# EAGLE design rx (EAGLE 7.2.0)
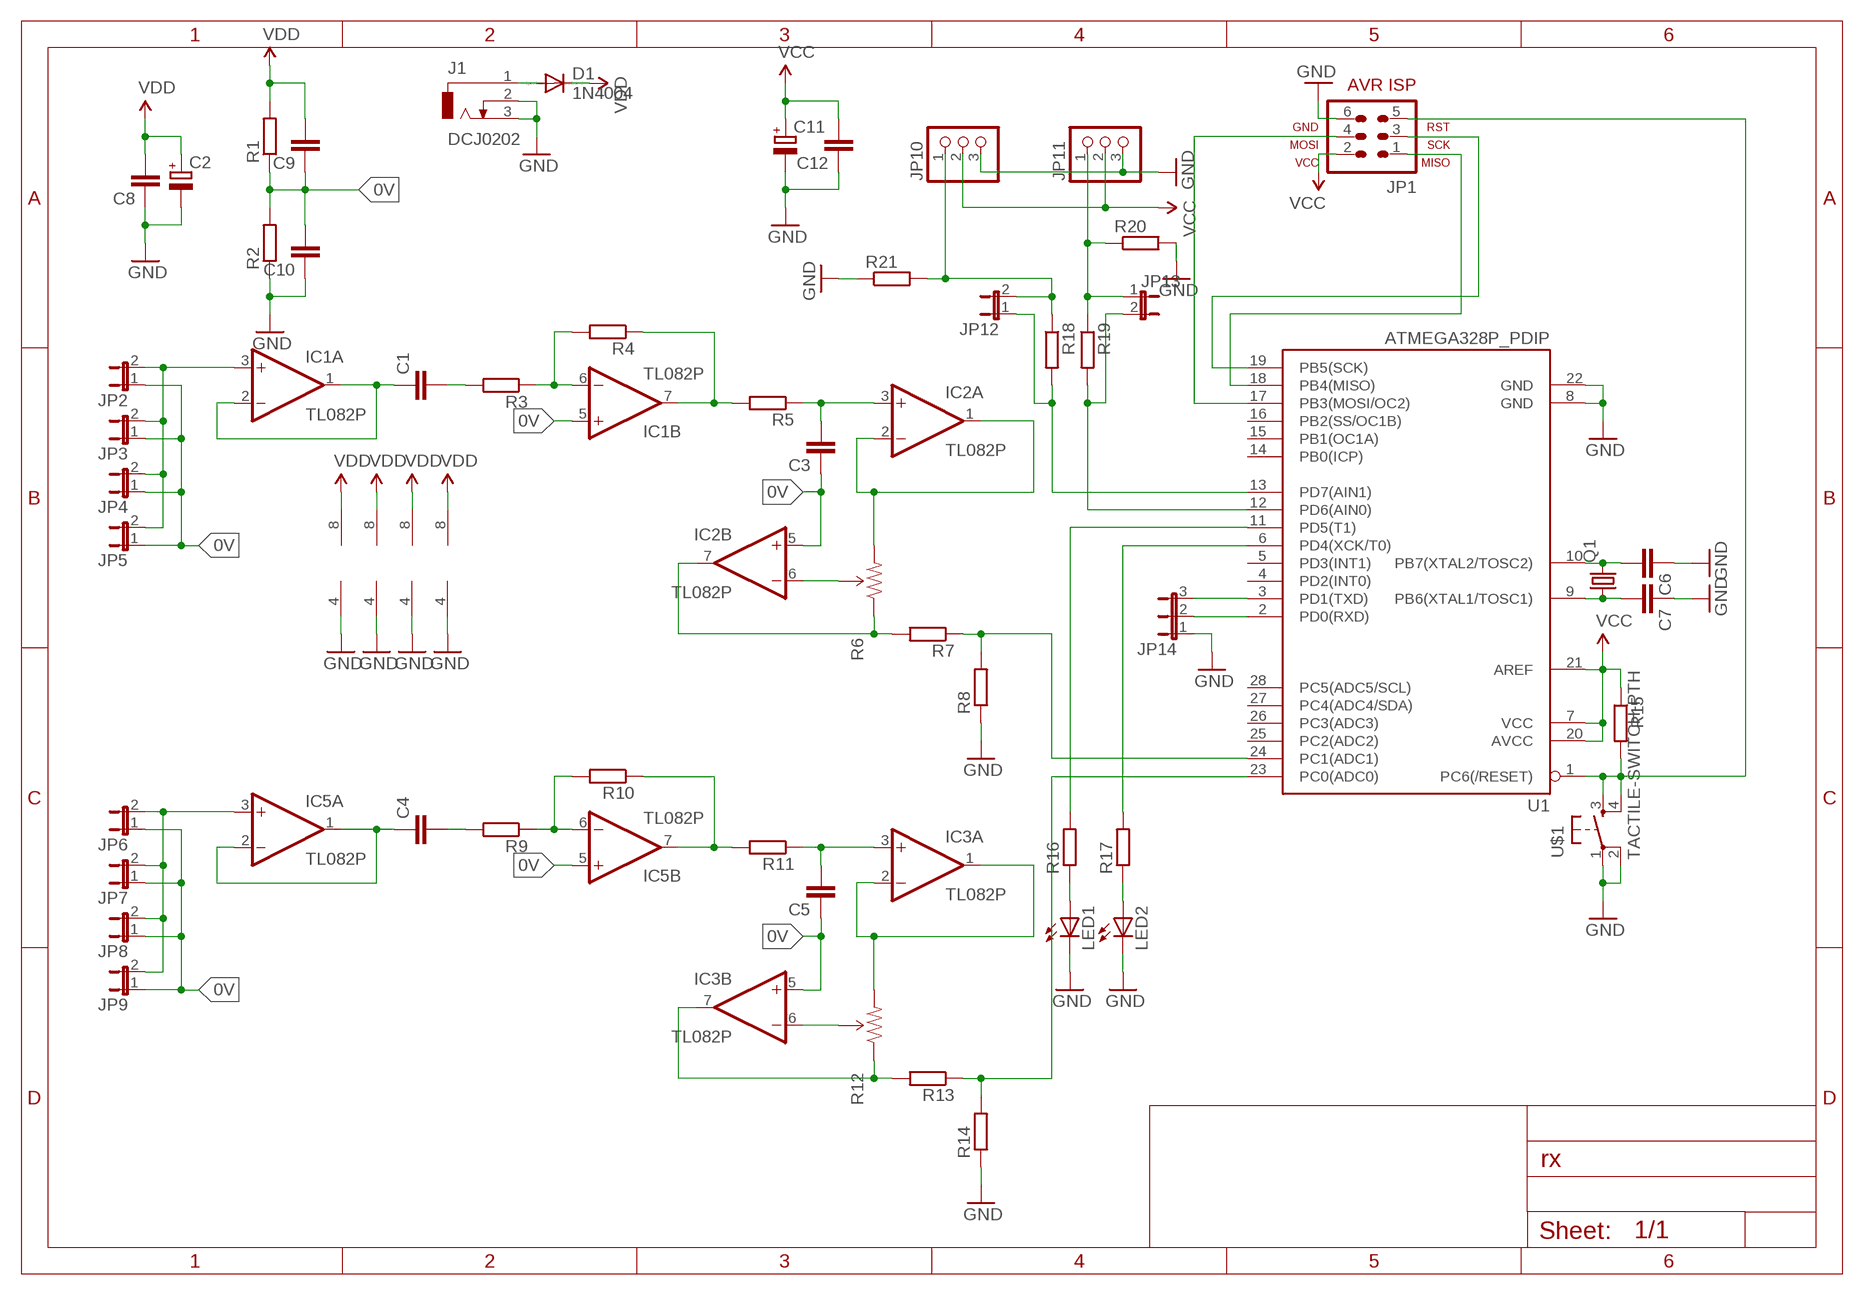
[diagram p0: schematic, sheet 1]

## Parts
C1  C-EU050-030X075  [C050-030X075]
C2  CPOL-EUE5-8.5  [E5-8,5]
C3  C-EU050-030X075  [C050-030X075]
C4  C-EU050-030X075  [C050-030X075]
C5  C-EU050-030X075  [C050-030X075]
C6  C-EU050-030X075  [C050-030X075]
C7  C-EU050-030X075  [C050-030X075]
C8  C-EU050-030X075  [C050-030X075]
C9  C-EU050-030X075  [C050-030X075]
C10  C-EU050-030X075  [C050-030X075]
C11  CPOL-EUE5-8.5  [E5-8,5]
C12  C-EU050-030X075  [C050-030X075]
D1  1N4004  [DO41-10]
IC1  TL082P  [DIL08]
IC2  TL082P  [DIL08]
IC3  TL082P  [DIL08]
IC5  TL082P  [DIL08]
J1  DCJ0202  [DCJ0202]
JP1  AVR-ISP-6VERT  [AVR-ISP-6]
JP2  JP1E  [JP1]
JP3  JP1E  [JP1]
JP4  JP1E  [JP1]
JP5  JP1E  [JP1]
JP6  JP1E  [JP1]
JP7  JP1E  [JP1]
JP8  JP1E  [JP1]
JP9  JP1E  [JP1]
JP10  PINHD-1X3/90  [1X03/90]
JP11  PINHD-1X3/90  [1X03/90]
JP12  JP1E  [JP1]
JP13  JP1E  [JP1]
JP14  JP2E  [JP2]
LED1  LED5MM  [LED5MM]
LED2  LED5MM  [LED5MM]
Q1  CRYSTALHC49U70  [HC49U70]
R1  R-EU_0207/10  [0207/10]
R2  R-EU_0207/10  [0207/10]
R3  R-EU_0207/10  [0207/10]
R4  R-EU_0207/2V  [0207/2V]
R5  R-EU_0207/2V  [0207/2V]
R6  TRIMPOTPTH  [TRIM_POT_PTH]
R7  R-EU_0207/10  [0207/10]
R8  R-EU_0207/10  [0207/10]
R9  R-EU_0207/10  [0207/10]
R10  R-EU_0207/2V  [0207/2V]
R11  R-EU_0207/2V  [0207/2V]
R12  TRIMPOTPTH  [TRIM_POT_PTH]
R13  R-EU_0207/10  [0207/10]
R14  R-EU_0207/10  [0207/10]
R15  R-EU_0207/10  [0207/10]
R16  R-EU_0207/10  [0207/10]
R17  R-EU_0207/10  [0207/10]
R18  R-EU_0207/10  [0207/10]
R19  R-EU_0207/10  [0207/10]
R20  R-EU_0207/10  [0207/10]
R21  R-EU_0207/10  [0207/10]
U1  ATMEGA328P_PDIP  [DIL28-3]
U$1  TACTILE-SWITCH-PTH  [TAC-SWITCH-PTH]

## Nets
0V: C3.1 C5.1 C9.1 C10.2 IC1.5(B:+IN) IC2.5(B:+IN) IC3.5(B:+IN) IC5.5(B:+IN) JP2.1 JP3.1 JP4.1 JP5.1 JP6.1 JP7.1 JP8.1 JP9.1 R1.1 R2.2
GND: C2.- C6.1 C7.1 C8.1 C10.1 C11.- C12.1 IC1.4(P:V-) IC2.4(P:V-) IC3.4(P:V-) IC5.4(P:V-) J1.2 J1.3 JP1.6 JP10.3 JP11.3 JP14.1 LED1.K(C) LED2.K(C) R2.1 R8.1 R14.1 R20.2 R21.1 U1.8(GND) U1.22(GND) U$1.1 U$1.2
N$1: C1.1 IC1.1(A:OUT) IC1.2(A:-IN)
N$2: IC1.3(A:+IN) JP2.2 JP3.2 JP4.2 JP5.2
N$3: C1.2 R3.2
N$4: IC1.6(B:-IN) R3.1 R4.2
N$5: IC1.7(B:OUT) R4.1 R5.2
N$6: IC2.1(A:OUT) IC2.2(A:-IN) R6.3(CW)
N$7: C3.2 IC2.3(A:+IN) R5.1
N$8: D1.A J1.1
N$9: IC2.6(B:-IN) R6.2(WIPER)
N$10: IC2.7(B:OUT) R6.1(CCW) R7.2
N$11: R7.1 R8.2 U1.24(PC1(ADC1))
N$12: IC5.3(A:+IN) JP6.2 JP7.2 JP8.2 JP9.2
N$13: C4.1 IC5.1(A:OUT) IC5.2(A:-IN)
N$14: C4.2 R9.2
N$15: IC5.6(B:-IN) R9.1 R10.2
N$16: IC5.7(B:OUT) R10.1 R11.2
N$17: IC3.1(A:OUT) IC3.2(A:-IN) R12.3(CW)
N$18: C5.2 IC3.3(A:+IN) R11.1
N$19: IC3.6(B:-IN) R12.2(WIPER)
N$20: IC3.7(B:OUT) R12.1(CCW) R13.2
N$21: R13.1 R14.2 U1.23(PC0(ADC0))
N$22: JP11.1 JP13.1 R19.1 R20.1
N$23: C7.2 Q1.1 U1.9(PB6(XTAL1/TOSC1))
N$24: C6.2 Q1.2 U1.10(PB7(XTAL2/TOSC2))
N$25: JP10.1 JP12.2 R18.1 R21.2
N$28: JP14.3 U1.3(PD1(TXD))
N$29: JP14.2 U1.2(PD0(RXD))
N$32: JP1.5 R15.2 U1.1(PC6(/RESET)) U$1.3 U$1.4
N$34: JP1.1 U1.18(PB4(MISO))
N$35: JP1.3 U1.19(PB5(SCK))
N$36: JP1.4 U1.17(PB3(MOSI/OC2))
N$37: LED1.A R16.1
N$38: LED2.A R17.1
N$39: R17.2 U1.6(PD4(XCK/T0))
N$40: R16.2 U1.11(PD5(T1))
N$43: JP13.2 R19.2 U1.12(PD6(AIN0))
N$44: JP12.1 R18.2 U1.13(PD7(AIN1))
VCC: C11.+ C12.2 JP1.2 JP10.2 JP11.2 R15.1 U1.7(VCC) U1.20(AVCC) U1.21(AREF)
VDD: C2.+ C8.2 C9.2 D1.C IC1.8(P:V+) IC2.8(P:V+) IC3.8(P:V+) IC5.8(P:V+) R1.2
Unconnected: U1.4(PD2(INT0)) U1.5(PD3(INT1)) U1.14(PB0(ICP)) U1.15(PB1(OC1A)) U1.16(PB2(SS/OC1B)) U1.25(PC2(ADC2)) U1.26(PC3(ADC3)) U1.27(PC4(ADC4/SDA)) U1.28(PC5(ADC5/SCL))

## Library data of the parts
C1 C3-C10 C12 = resistor:C-EU: CAPACITOR, European symbol
C2 C11 = resistor:CPOL-EU: POLARIZED CAPACITOR, European symbol
D1 = diode:1N4004: DIODE general purpose rectifier, 1 A
IC1-IC3 IC5 = linear:TL082: OP AMP Data sheet <http://www.ti.com/lit/ds/symlink/tl084a . pdf>; DATA_SHEET: <a href="http://www.ti.com/lit/ds/symlink/tl084a.pdf"> Data sheet </a>
J1 = con-jack:DCJ0202: DC POWER JACK Source: DCJ0202.pdf; OC_FARNELL: unknown; OC_NEWARK: unknown
JP1 = avr-7:AVR-ISP-6: AVR ISP-6 Serial Programming Header
JP2-JP9 JP12 JP13 = jumper:JP1E: JUMPER
JP10 JP11 = pinhead:PINHD-1X3: PIN HEADER
JP14 = jumper:JP2E: JUMPER
LED1 LED2 = led:LED: LED OSRAM: - CHIPLED LG R971, LG N971, LY N971, LG Q971, LY Q971, LO R971, LY R971 LH N974, LH R974 LS Q976, LO Q976, LY Q976 LO Q996 - Hyper CHIPLED LW Q18S LB Q993, LB Q99A, LB R99A - SideLED LS A670, LO A670, LY A670, LG A670, LP A670 LB A673, LV A673, LT A673, LW A673 LH A674 LY A675 LS A676, LA A676, LO A676, LY A676, LW A676 LS A679, LY A679, LG A679 - Hyper Micro SIDELED® LS Y876, LA Y876, LO Y876, LY Y876 LT Y87S - SmartLED LW L88C, LW L88S LB L89C, LB L89S, LG L890 LS L89K, LO L89K, LY L89K LS L896, LA L896, LO L896, LY L896 - TOPLED LS T670, LO T670, LY T670, LG T670, LP T670 LSG T670, LSP T670, LSY T670, LOP T670, LYG T670 LG T671, LOG T671, LSG T671 LB T673, LV T673, LT T673, LW T673 LH T674 LS T676, LA T676, LO T676, LY T676, LB T676, LH T676, LSB T676, LW T676 LB T67C, LV T67C, LT T67C, LS T67K, LO T67K, LY T67K, LW E67C LS E67B, LA E67B, LO E67B, LY E67B, LB E67C, LV E67C, LT E67C LW T67C LS T679, LY T679, LG T679 LS T770, LO T770, LY T770, LG T770, LP T770 LB T773, LV T773, LT T773, LW T773 LH T774 LS E675, LA E675, LY E675, LS T675 LS T776, LA T776, LO T776, LY T776, LB T776 LHGB T686 LT T68C, LB T68C - Hyper Mini TOPLED® LB M676 - Mini TOPLED Santana® LG M470 LS M47K, LO M47K, LY M47K Source: http://www.osram.convergy.de LUXEON: - LUMILED® LXK2-PW12-R00, LXK2-PW12-S00, LXK2-PW14-U00, LXK2-PW14-V00 LXK2-PM12-R00, LXK2-PM12-S00, LXK2-PM14-U00 LXK2-PE12-Q00, LXK2-PE12-R00, LXK2-PE12-S00, LXK2-PE14-T00, LXK2-PE14-U00 LXK2-PB12-K00, LXK2-PB12-L00, LXK2-PB12-M00, LXK2-PB14-N00, LXK2-PB14-P00, LXK2-PB14-Q00 LXK2-PR12-L00, LXK2-PR12-M00, LXK2-PR14-Q00, LXK2-PR14-R00 LXK2-PD12-Q00, LXK2-PD12-R00, LXK2-PD12-S00 LXK2-PH12-R00, LXK2-PH12-S00 LXK2-PL12-P00, LXK2-PL12-Q00, LXK2-PL12-R00 Source: www.luxeon.com KINGBRIGHT: KA-3528ASYC Source: www.kingbright.com
Q1 = crystal:CRYSTAL: CRYSTAL; OC_FARNELL: unknown; OC_NEWARK: unknown
R1-R5 R7-R11 R13-R21 = resistor:R-EU_: RESISTOR, European symbol
R6 R12 = SparkFun-Electromechanical:TRIMPOT: Various small potentiometers for "set-and-forget" applications
U1 = SparkFun-DigitalIC:ATMEGA328P_PDIP: uC used in the Arduino 32kb flash, 1k EEPROM, 2k SRAM This is the through-hole version of this chip.
U$1 = GeekAmmo:TACTILE-SWITCH: Tactile Switch 4 Pins, SPST NO

## Board
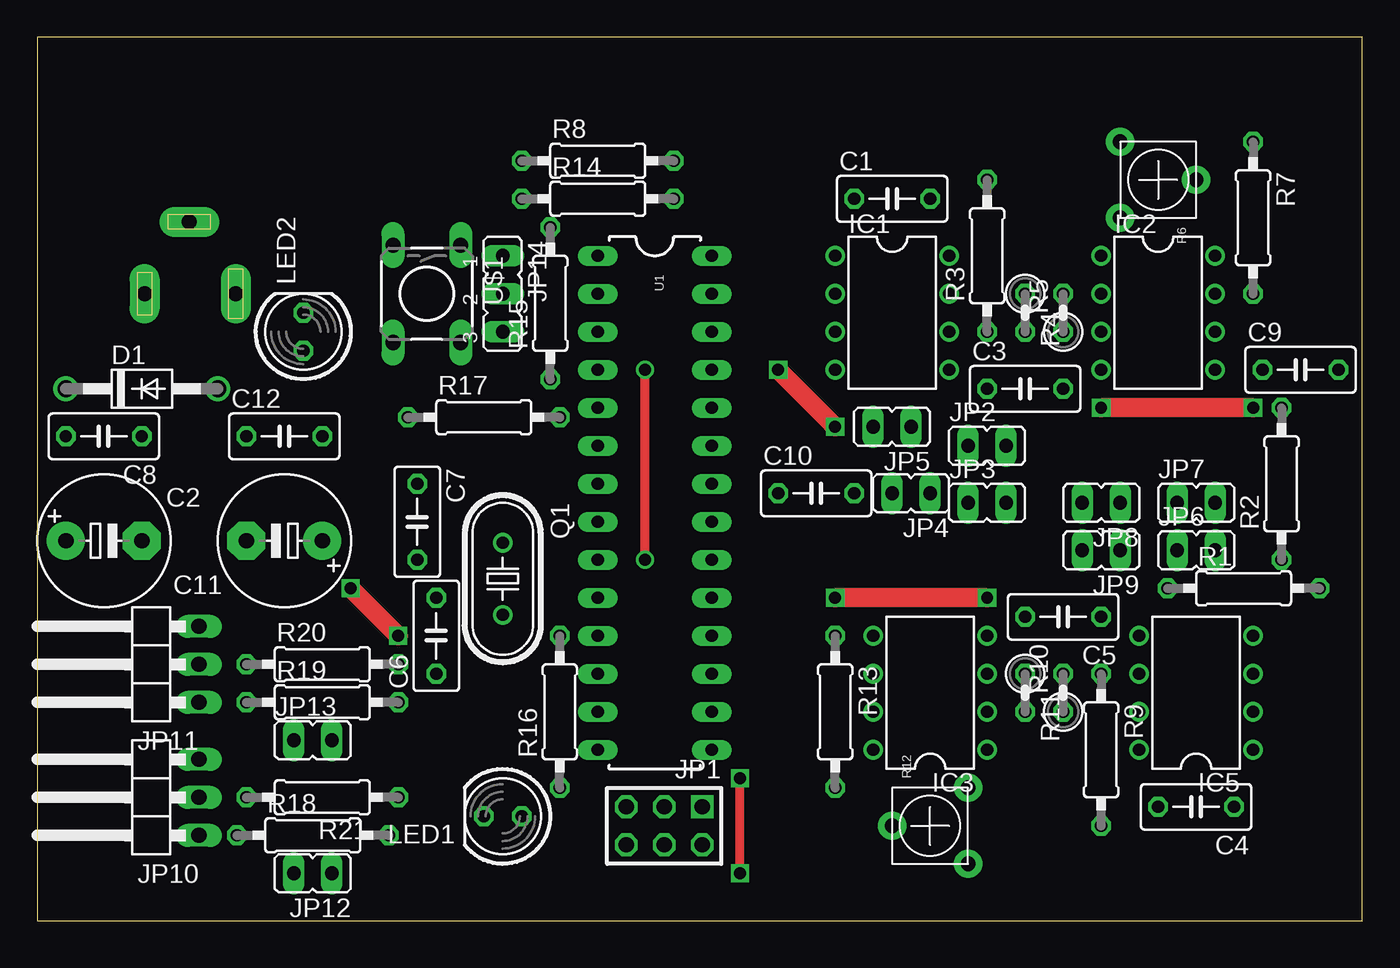
[diagram p1: board, top side]
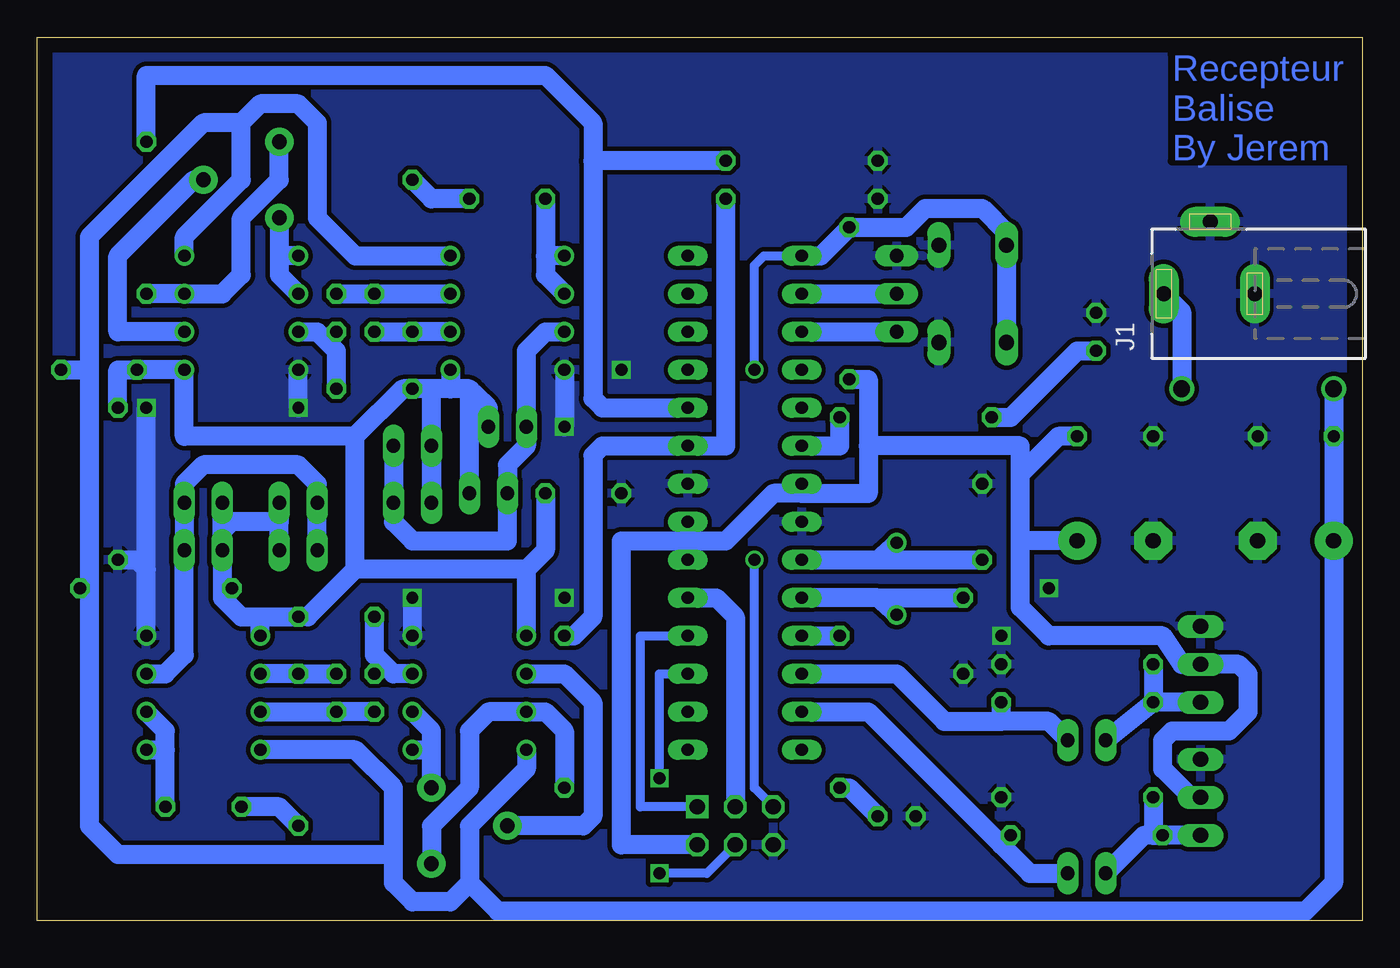
[diagram p2: board, bottom side, seen from below]

Size 88.57 x 59.05 mm. Coordinates in mm from the lower left corner, seen from the top.
Outline: 0,0 88.57,0 88.57,59.05 0,59.05 0,0
Copper layers (1*16): Top 0.035mm / dielectric 1.5mm / Bottom 0.035mm
Design rules "default": minimum track width 10mil, minimum drill 24mil, track to track 8mil, track to pad 8mil, pad to pad 8mil, via to via 8mil, smd to smd 8mil, copper to edge 40mil, drill to drill 8mil, minimum pad ring 10mil, minimum via ring 8mil, stop-mask expansion 4mil, vias tented up to drill 0mil, thermal gap 10mil

### Footprints (pad centres in the part's own frame; a part is rotated, then mirrored left to right if it is on the bottom)
C050-030X075 = drill 0.813 octagon: 1 -2.54,0; 2 2.54,0
E5-8,5 = drill 1.016 pad 2.54: + -2.54,0 | drill 1.016 pad 2.54 octagon: - 2.54,0
DO41-10 = drill 1.118: A 5.08,0; C -5.08,0
DIL08 = drill 0.813 pad 1.27: 1 -3.81,-3.81; 2 -1.27,-3.81; 3 1.27,-3.81; 4 3.81,-3.81; 5 3.81,3.81; 6 1.27,3.81; 7 -1.27,3.81; 8 -3.81,3.81
DCJ0202 = drill 1 pad 2 long: 1 0,3.1; 2 4.8,0; 3 0,-3
AVR-ISP-6 = drill 1.016 square: 1 -2.54,-1.27 | drill 1.016 octagon: 2 -2.54,1.27; 3 0,-1.27; 4 0,1.27; 5 2.54,-1.27; 6 2.54,1.27
JP1 = drill 0.914 long: 1 0,-1.27; 2 0,1.27
1X03/90 = drill 1.016 long: 1 -2.54,-3.81; 2 0,-3.81; 3 2.54,-3.81
JP2 = drill 0.914 long: 1 -2.54,0; 2 0,0; 3 2.54,0
LED5MM = drill 0.813 octagon: A -1.27,0; K 1.27,0
HC49U70 = drill 0.813: 1 -2.413,0; 2 2.413,0
0207/10 = drill 0.813 octagon: 1 -5.08,0; 2 5.08,0
0207/2V = drill 0.813 octagon: 1 -1.27,0; 2 1.27,0
TRIM_POT_PTH = drill 1 pad 1.88: 1 -2.54,-2.54; 2 0,2.54; 3 2.54,-2.54
DIL28-3 = drill 0.813 long: 1 -16.51,-3.81; 2 -13.97,-3.81; 3 -11.43,-3.81; 4 -8.89,-3.81; 5 -6.35,-3.81; 6 -3.81,-3.81; 7 -1.27,-3.81; 8 1.27,-3.81; 9 3.81,-3.81; 10 6.35,-3.81; 11 8.89,-3.81; 12 11.43,-3.81; 13 13.97,-3.81; 14 16.51,-3.81; 15 16.51,3.81; 16 13.97,3.81; 17 11.43,3.81; 18 8.89,3.81; 19 6.35,3.81; 20 3.81,3.81; 21 1.27,3.81; 22 -1.27,3.81; 23 -3.81,3.81; 24 -6.35,3.81; 25 -8.89,3.81; 26 -11.43,3.81; 27 -13.97,3.81; 28 -16.51,3.81
TAC-SWITCH-PTH = drill 1.016 pad 1.524 long: 1 -3.251,2.261; 2 3.251,2.261; 3 -3.251,-2.261; 4 3.251,-2.261

### Placement (x,y rotation side)
C1  57.15,48.26 0 top
C2  4.45,25.4 0 top
C3  66.04,35.56 0 top
C4  77.47,7.62 180 top
C5  68.58,20.32 180 top
C6  26.67,19.05 90 top
C7  25.4,26.67 270 top
C8  4.45,32.38 180 top
C9  84.45,36.83 0 top
C10  52.07,28.57 0 top
C11  16.51,25.4 180 top
C12  16.51,32.38 0 top
D1  6.99,35.56 0 top
IC1  57.15,40.64 270 top
IC2  74.93,40.64 270 top
IC3  59.69,15.24 90 top
IC5  77.47,15.24 90 top
J1  10.16,41.91 90 bottom
JP1  41.91,6.35 180 top
JP2  63.5,31.75 270 top
JP3  63.5,27.94 270 top
JP4  58.42,28.57 90 top
JP5  57.15,33.02 90 top
JP6  77.47,24.77 270 top
JP7  77.47,27.94 270 top
JP8  71.12,27.94 90 top
JP9  71.12,24.77 90 top
JP10  6.99,8.26 90 top
JP11  6.99,17.14 90 top
JP12  18.41,3.17 90 top
JP13  18.41,12.06 270 top
JP14  31.11,41.91 270 top
LED1  31.11,6.99 180 top
LED2  17.78,39.37 90 top
Q1  31.11,22.86 270 top
R1  80.64,22.23 0 top
R2  83.19,29.21 90 top
R3  63.5,44.45 90 top
R4  66.04,40.64 270 top
R5  68.58,40.64 90 top
R6  74.93,49.53 270 top
R7  81.28,46.99 270 top
R8  37.47,50.8 0 top
R9  71.12,11.43 270 top
R10  68.58,15.24 90 top
R11  66.04,15.24 270 top
R12  59.69,6.35 90 top
R13  53.34,13.97 270 top
R14  37.47,48.26 0 top
R15  34.29,41.27 90 top
R16  34.92,13.97 90 top
R17  29.84,33.66 0 top
R18  18.41,5.71 0 top
R19  19.05,14.61 0 top
R20  19.05,17.14 0 top
R21  19.05,8.26 180 top
U1  41.27,27.94 270 top
U$1  26.04,41.91 270 top

### Tracks (layer width: path | path; a pad name or v marks a point on that pad's centre or on a via)
0V
  Bottom 1.27: JP5.1 58.42,34.29 59.37,35.24 | 59.37,35.24 59.69,35.56 60.96,35.56 | 60.96,35.56 62.23,35.56 | 62.23,35.56 C3.1 64.14,35.56 67.31,32.38 | IC1.5 60.96,35.56 | JP2.1 JP3.1 62.23,35.56 | 67.31,32.38 78.74,32.38 IC2.5 C9.1 83.19,36.83 R2.2 | 76.2,21.59 JP6.1 76.2,26.04 | 76.2,21.59 74.93,20.32 73.66,20.32 | 73.66,20.32 C5.1 70.48,20.32 67.31,23.5 | IC5.5 73.66,20.32 | 76.2,26.04 JP7.1 | JP9.1 72.39,26.67 | JP8.1 72.39,26.67 | 72.39,26.67 75.56,26.67 76.2,26.04 | IC3.5 55.88,23.5 | 55.88,23.5 67.31,23.5 | 67.31,23.5 67.31,32.38 | R1.1 76.2,21.59 | C10.2 54.61,24.77 55.88,23.5 | JP4.1 59.69,34.92 59.37,35.24
GND  (via drill 0.8)
  Top 1.27: v63.5,21.59 v53.34,21.59 | v81.28,34.29 v71.12,34.29 | v53.34,33.02 v49.53,36.83 | v20.95,22.23 v24.13,19.05
  Bottom 1.27: IC3.4 v63.5,21.59 | IC5.4 81.28,23.5 | 81.28,23.5 v81.28,34.29 | v71.12,34.29 IC2.4 | R2.1 81.92,24.13 81.28,23.5 | IC1.4 v53.34,33.02
  pour Bottom (isolate 0.3): 88.27,58.42 0,58.42 0,0 88.27,0
N$1
  Bottom 1.27: C1.1 54.61,44.45 | 54.61,44.45 54.61,43.18 IC1.2 | IC1.1 54.61,44.45
N$2
  Bottom 1.27: IC1.3 54.61,39.37 55.88,38.1 JP5.2 55.88,31.75 57.15,30.48 JP4.2 57.15,25.4 63.5,25.4 64.77,26.67 JP3.2 JP2.2
N$3
  Bottom 1.27: C1.2 62.23,48.26 R3.2
N$4
  Bottom 1.27: R4.2 R3.1 IC1.6
N$5
  Bottom 1.27: IC1.7 R4.1 R5.2
N$6
  Bottom 1.27: R6.3 72.39,44.45 | 72.39,44.45 72.39,43.18 IC2.2 | IC2.1 72.39,44.45
N$7
  Bottom 1.27: IC2.3 69.85,39.37 69.22,38.73 | 69.22,38.73 68.58,38.1 C3.2 | R5.1 69.22,38.73
N$8
  Bottom 1.27: J1.1 12.06,40.72 D1.A
N$9
  Bottom 1.27: IC2.6 83.19,39.37 83.19,44.45 78.11,49.53 R6.2
N$10
  Bottom 1.27: R6.1 72.39,49.53 74.93,46.99 74.93,43.18 76.2,41.91 IC2.7 R7.2
N$11
  Bottom 1.27: R7.1 81.28,56.52 54.61,56.52 51.44,53.34 51.44,50.8 | 51.44,50.8 51.44,34.92 50.8,34.29 U1.24 | R8.2 51.44,50.8
N$12
  Bottom 1.27: IC5.3 80.01,16.51 78.74,17.78 JP6.2 JP7.2 78.74,29.21 77.47,30.48 71.12,30.48 69.85,29.21 JP8.2 JP9.2
N$13
  Bottom 1.27: C4.1 80.01,11.43 | 80.01,11.43 80.01,12.7 IC5.2 | IC5.1 80.01,11.43
N$14
  Bottom 1.27: R9.2 72.39,7.62 C4.2
N$15
  Bottom 1.27: R10.2 R9.1 IC5.6
N$16
  Bottom 1.27: IC5.7 R10.1 R11.2
N$17
  Bottom 1.27: R12.3 62.23,11.43 | 62.23,11.43 62.23,12.7 IC3.2 | IC3.1 62.23,11.43
N$18
  Bottom 1.27: IC3.3 64.77,16.51 65.41,17.14 | 65.41,17.14 66.04,17.78 C5.2 | R11.1 65.41,17.14
N$19
  Bottom 1.27: IC3.6 53.34,16.51 51.44,14.61 51.44,6.99 52.07,6.35 R12.2
N$20
  Bottom 1.27: R12.1 62.23,6.35 59.69,8.89 59.69,12.7 58.42,13.97 IC3.7 54.61,13.97 53.34,12.7 R13.2
N$21
  Bottom 1.27: R13.1 52.7,19.05 51.44,20.32 51.44,31.11 50.8,31.75 U1.23 42.55,31.75 R14.2
N$22
  Bottom 1.27: JP11.1 R19.1 | R19.1 JP13.1 | R20.1 R19.1
N$23
  Bottom 1.27: U1.9 32.38,24.13 | Q1.1 32.38,24.13 | 32.38,24.13 C7.2
N$24
  Bottom 1.27: 32.38,21.59 U1.10 | Q1.2 32.38,21.59 | 32.38,21.59 C6.2
N$25
  Bottom 1.27: JP10.1 R18.1 | R21.2 13.97,5.71 R18.1 | R18.1 14.61,5.71 JP12.2
N$28
  Bottom 1.27: U1.3 JP14.3
N$29
  Bottom 1.27: U1.2 JP14.2
N$32  (via drill 0.8)
  Top 0.61: v40.64,24.13 v40.64,36.83
  Bottom 0.61: JP1.5 40.64,8.89 v40.64,24.13 | v40.64,36.83 40.64,43.81 40.01,44.45 U1.1
  Bottom 1.27: U$1.4 U$1.3 23.77,46 25.4,47.62 29.21,47.62 30.48,46.35 R15.2 36.2,44.45 U1.1
N$34
  Bottom 0.61: JP1.1 48.26,7.62 48.26,19.05 U1.18
N$35
  Bottom 1.27: U1.19 43.18,21.59 41.91,20.32 JP1.3
N$36  (via drill 0.8)
  Top 0.61: v46.99,3.17 v46.99,9.53
  Bottom 0.61: JP1.4 43.81,3.17 v46.99,3.17 | v46.99,9.53 46.99,16.51 U1.17
N$37
  Bottom 1.27: R16.1 34.29,8.89 LED1.A
N$38
  Bottom 1.27: LED2.A 19.05,38.1 23.5,33.66 R17.1
N$39
  Bottom 1.27: U1.6 34.92,31.75 R17.2
N$40
  Bottom 1.27: U1.11 R16.2
N$43
  Bottom 1.27: U1.12 31.11,16.51 27.94,13.34 24.13,13.34 | JP13.2 20.95,13.34 24.13,13.34 | 24.13,13.34 R19.2
N$44
  Bottom 1.27: U1.13 33.02,13.97 24.13,5.08 | 24.13,5.08 22.23,3.17 JP12.1 | R18.2 24.13,5.08
VCC
  Bottom 1.27: JP1.2 49.53,5.08 49.53,25.4 45.09,25.4 | 45.09,25.4 44.45,25.4 | 44.45,25.4 42.55,25.4 39.37,28.57 37.47,28.57 | U1.20 45.09,24.77 44.45,25.4 | U1.21 45.09,25.4 | U1.7 37.47,28.57 | JP10.2 11.43,8.26 13.34,10.16 13.34,12.06 12.7,12.7 8.89,12.7 7.62,13.97 7.62,16.51 8.26,17.14 JP11.2 12.06,17.14 13.34,19.05 20.95,19.05 22.86,20.95 22.86,25.4 | 22.86,25.4 22.86,29.84 | 37.47,28.57 33.02,28.57 33.02,31.75 | C11.+ 22.86,25.4 | C12.2 20.32,32.38 22.86,29.84 | 33.02,31.75 33.02,36.2 R15.1 | 22.86,29.84 22.86,31.75 33.02,31.75
VDD
  Bottom 1.27: IC2.8 78.74,45.72 74.93,49.53 74.93,53.34 | IC1.8 67.31,44.45 69.85,46.99 69.85,53.34 71.12,54.61 73.66,54.61 74.93,53.34 | IC3.8 55.88,10.16 59.69,6.35 59.69,2.54 | 59.69,2.54 60.96,1.27 63.5,1.27 64.77,2.54 64.77,4.45 | 64.77,4.45 64.77,8.89 67.31,11.43 IC5.8 | D1.C C8.2 C2.+ 1.91,2.54 3.81,0.64 57.78,0.64 59.69,2.54 | 74.93,53.34 77.47,53.34 85.09,45.72 85.09,36.83 | 85.09,36.83 85.09,22.23 | 85.09,22.23 85.09,6.35 83.19,4.45 64.77,4.45 | R1.2 85.09,22.23 | C9.2 85.09,36.83

### Text on the board
Bottom: Recepteur / Balise / By Jerem